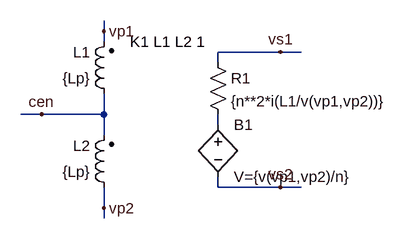
[diagram p0: schematic trafo.asc]
trafo.asc, the LTspice schematic file:
Version 4
SHEET 1 880 680
WIRE 128 48 128 32
WIRE 128 64 128 48
WIRE 400 80 304 80
WIRE 432 80 400 80
WIRE 304 96 304 80
WIRE 32 176 0 176
WIRE 128 176 128 144
WIRE 128 176 32 176
WIRE 304 192 304 176
WIRE 128 208 128 176
WIRE 304 288 304 272
WIRE 400 288 304 288
WIRE 432 288 400 288
WIRE 128 320 128 288
WIRE 128 336 128 320
FLAG 128 48 vp1
FLAG 128 320 vp2
FLAG 32 176 cen
FLAG 400 80 vs1
FLAG 400 288 vs2
SYMBOL ind2 144 160 R180
WINDOW 0 36 80 Left 2
WINDOW 3 36 40 Left 2
SYMATTR InstName L1
SYMATTR Value {Lp}
SYMATTR Type ind
SYMATTR SpiceLine Rser={Rmul*Lp}
SYMBOL ind2 144 304 R180
WINDOW 0 36 80 Left 2
WINDOW 3 36 40 Left 2
SYMATTR InstName L2
SYMATTR Value {Lp}
SYMATTR Type ind
SYMATTR SpiceLine Rser={Rmul*Lp}
SYMBOL bv 304 176 R0
SYMATTR InstName B1
SYMATTR Value V={v(vp1,vp2)/n}
SYMBOL res 288 80 R0
SYMATTR InstName R1
SYMATTR Value {n**2*i(L1/v(vp1,vp2))}
TEXT 168 64 Left 2 !K1 L1 L2 1

The netlist it stands for:
* trafo.asc
L1 cen vp1 {Lp} Rser={Rmul*Lp}
L2 vp2 cen {Lp} Rser={Rmul*Lp}
B1 N001 vs2 V={v(vp1,vp2)/n}
R1 vs1 N001 {n**2*i(L1/v(vp1,vp2))}
K1 L1 L2 1
.backanno
.end